# Altium schematic sheet [06] - SD CARD.SchDoc
size A3; DocumentNumber: 6; SheetNumber: 6; SheetTotal: 18
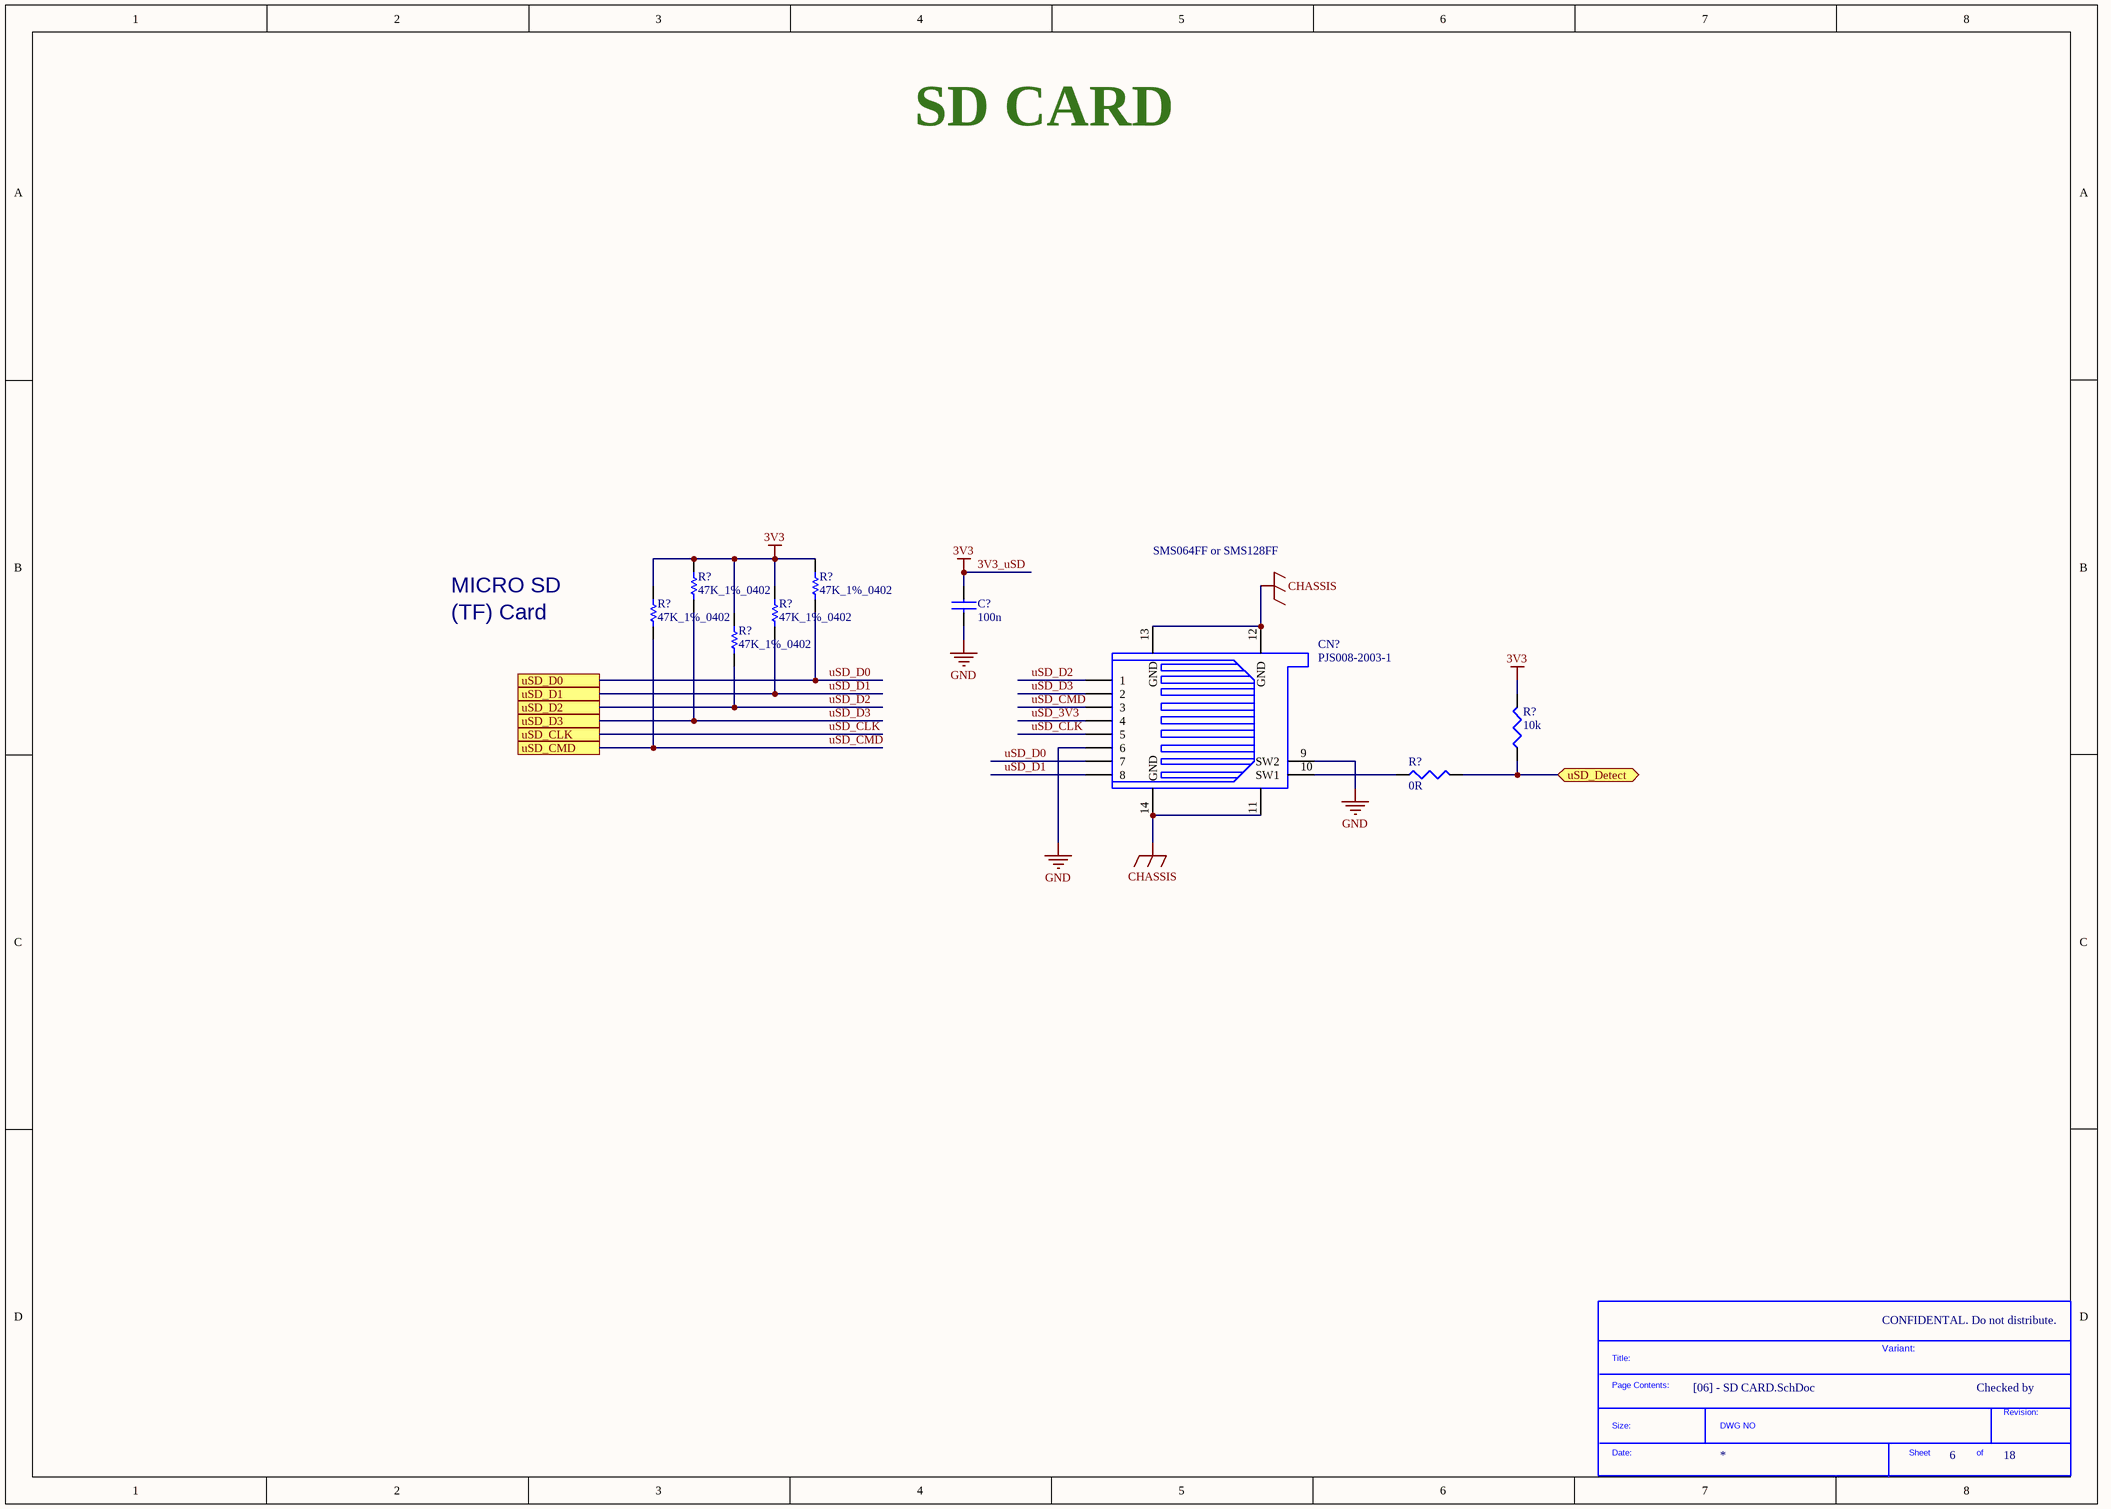
[diagram p0: [06] - SD CARD.SchDoc]

## Parts
(Parts that share a designator on the sheet are numbered #1, #2 ... from top to bottom, then left to right.)
*  SDTitleBlock  (value not drawn)  (graphical)
C?  100n  [C0402]
CN?  PJS008-2003-1  [PJS008-2003-1]
R?#1  47K_1%_0402  [0402R]
R?#2  47K_1%_0402  [0402R]
R?#3  47K_1%_0402  [0402R]
R?#4  47K_1%_0402  [0402R]
R?#5  47K_1%_0402  [0402R]
R?#6  10k  [R0402]
R?#7  0R  [R0402]

## Ports
uSD_CLK, uSD_CMD, uSD_D0, uSD_D1, uSD_D2, uSD_D3, uSD_Detect (bidir)

## Nets
3V3_uSD: C?.1 R?#1.2 R?#2.2 R?#3.2 R?#4.2 R?#5.2 R?#6.2  [also labelled 3V3]
CHASSIS: CN?.11(GND) CN?.12(GND) CN?.13(GND) CN?.14(GND)
GND: C?.2 CN?.6 CN?.9(SW2)
uSD_3V3: CN?.4
uSD_CLK: CN?.5 ; port uSD_CLK
uSD_CMD: CN?.3 R?#3.1 ; port uSD_CMD
uSD_D0: CN?.7 R?#2.1 ; port uSD_D0
uSD_D1: CN?.8 R?#4.1 ; port uSD_D1
uSD_D2: CN?.1 R?#5.1 ; port uSD_D2
uSD_D3: CN?.2 R?#1.1 ; port uSD_D3
uSD_Detect: R?#6.1 R?#7.2 ; port uSD_Detect
NetCN?_10: CN?.10(SW1) R?#7.1

## Notes on the sheet
- SD CARD
- SMS064FF or SMS128FF
- MICRO SD
- (TF) Card
- CONFIDENTAL. Do not distribute.
- CLOCKS (CPU & PCIE)
- Variant:
- Checked by
- (in symbol SDTitleBlock) Title:; Page Contents:; Revision:; Size:; DWG NO; Date:; Sheet; of

## Library data of the parts
C? = C1005X5R1H104K: CAP CER .10UF 50V X5R 10% 0402; Manufacturer: TDK Corporation; Capacitance: 0.1µF; Value: 100nF; .Checked PCB: used; Category: Capacitors; Supplier Part Number: 445-5942-1-ND; Manufacturer Part Number: C1005X5R1H104K; Operating Temperature: -55°C ~ 85°C; Package / Case: 0402 (1005 Metric); Price 1k [$]: 0.02340; .Checked SCH: used; Voltage - Rated: 50V; Supplier: Digikey; Supplier 1: Digi-Key; Supplier Part Number 1: 445-5942-1-ND; RoHS: RoHS Compliant; Stock 1: 106926; Pricing 1: 1=0.27, 10=0.18, 100=0.072, 250=0.05176, 500=0.0369, 1000=0.027 (USD); Tolerance: ±10%; Temperature Coefficient: X5R; Mounting Type: Surface Mount, MLCC; Applications: General Purpose; Ratings: -; Size / Dimension: 0.039" L x 0.020" W (1.00mm x 0.50mm); Height - Seated (Max): -; Thickness (Max): 0.022" (0.55mm); Lead Spacing: -; Features: -; Packaging: Cut Tape (CT); Lead Style: -; ComponentLink1URL: http://www.tdk.co.jp/tefe02/e412_c.pdf; ComponentLink1Description: http://www.tdk.co.jp/tefe02/e412_c.pdf
CN? = microSD-PJS008-2003: Memory Card Connectors MicroSD Card Conn Revrs Mnt Push-Push; Manuf_1: YAMAICHI; Manuf_Part_1: PJS008-2003-1; ECCN_US/EU: N/A; Order: PJS008-2003-1
R?#1-R?#5 = Res_47K_1%_0402: Resistor,47K,0402,1%,YAGEO; Manuf_Part_1: RC0402FR-0747KL; Order: 9239430; Value: 47K; Manuf_1: YAGEO; ECCN_US/EU: n/a; Distrib: FARNELL
R?#6 = RC0402FR-0710KL: RES 10.0K OHM 1/16W 1% 0402 SMD; Manufacturer: Yageo; Power (Watts): 0.063W, 1/16W; .Checked PCB: used; Temperature Coefficient: ±100ppm/°C; Category: Resistors; Supplier Part Number: 311-10.0KLRCT-ND; Manufacturer Part Number: RC0402FR-0710KL; Package / Case: 0402 (1005 Metric); Price 1k [$]: 0.01421; Resistance (Ohms): 10K; Tolerance: ±1%; Value: 10k; .Checked SCH: used; Supplier: Digikey; Supplier 1: Digi-Key; Supplier Part Number 1: 311-10.0KLRCT-ND; RoHS: RoHS Compliant; Stock 1: 2916495; Pricing 1: 10=0.014, 50=0.0104, 100=0.0079, 250=0.00584, 500=0.00432, 1000=0.00288 (USD); Composition: Thick Film; Features: -; Size / Dimension: 0.039" L x 0.020" W (1.00mm x 0.50mm); Height: 0.016" (0.40mm); Number of Terminations: 2; Packaging: Cut Tape (CT); ComponentLink1URL: http://www.yageo.com/documents/recent/PYu-RC0402_51_RoHS_L_6.pdf; ComponentLink1Description: http://www.yageo.com/documents/recent/PYu-RC0402_51_RoHS_L_6.pdf
R?#7 = CRCW0402330RFKED: RES 330 OHM 1/16W 1% 0402 SMD; Manufacturer: Vishay Dale; Resistance (Ohms): 330; Power (Watts): 0.063W, 1/16W; Temperature Coefficient: ±100ppm/°C; .Checked PCB: RF; Supplier 1: Digi-Key; Supplier Part Number 1: 541-330LCT-ND; Manufacturer Part Number: CRCW0402330RFKED; RoHS: RoHS Compliant; Category: Resistors; Stock 1: 49303; Pricing 1: 10=0.083, 50=0.0444, 200=0.0255, 1000=0.0174 (USD); Composition: Thick Film; Features: -; Tolerance: ±1%; Package / Case: 0402 (1005 Metric); Size / Dimension: 0.039" L x 0.020" W (1.00mm x 0.50mm); Height: 0.016" (0.40mm); Number of Terminations: 2; Packaging: Cut Tape (CT); ComponentLink1URL: http://www.vishay.com/doc?20035; ComponentLink1Description: http://www.vishay.com/doc?20035; .Checked SCH: RF